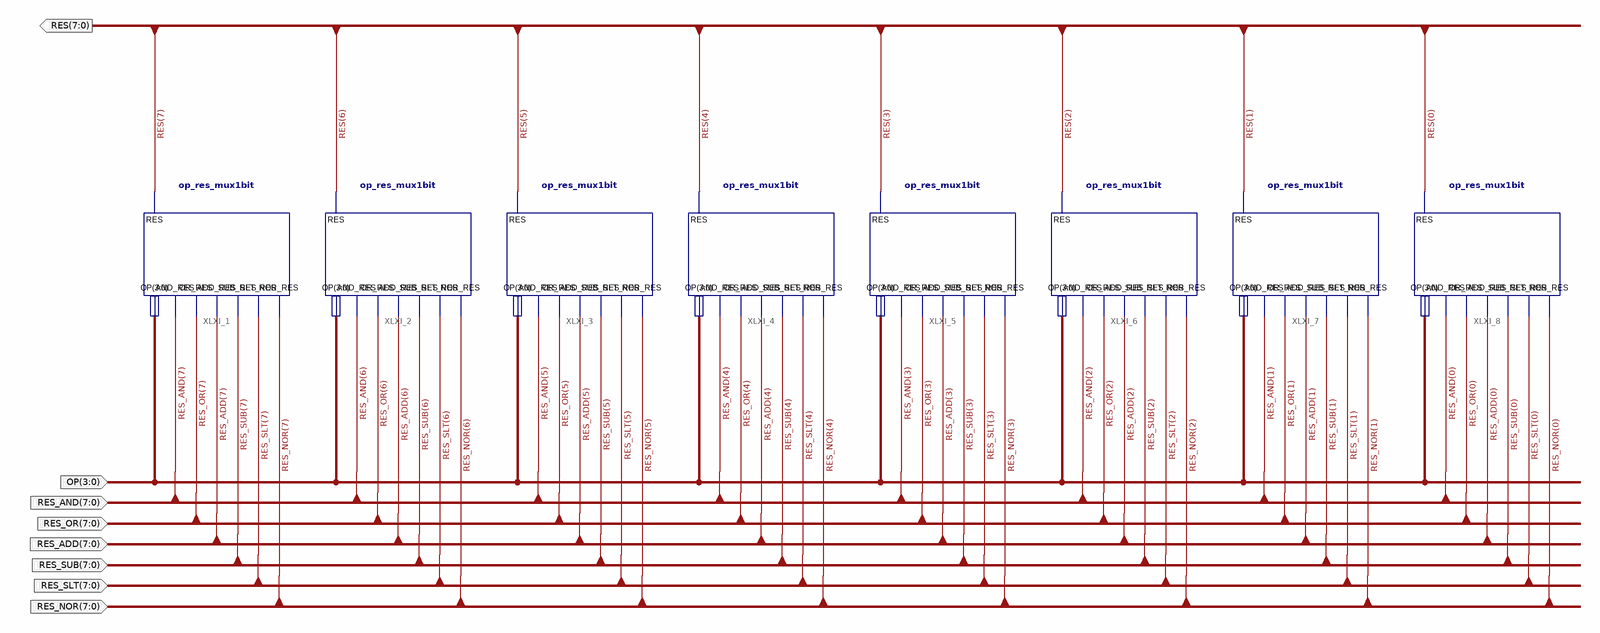
[diagram p0: schematic sheet 1]
// Xilinx ISE schematic op_res_mux8bit.sch (spartan3e) as structural Verilog: 8 symbols, 8 ports
module op_res_mux8bit (
  input  [3:0] OP,
  input  [7:0] RES_AND,
  input  [7:0] RES_OR,
  input  [7:0] RES_ADD,
  input  [7:0] RES_SUB,
  input  [7:0] RES_SLT,
  input  [7:0] RES_NOR,
  output [7:0] RES
);

  op_res_mux1bit XLXI_1 (
    .RES(RES[7]), .ADD_RES(RES_ADD[7]), .SUB_RES(RES_SUB[7]), .SLT_RES(RES_SLT[7]), .NOR_RES(RES_NOR[7]),
    .AND_RES(RES_AND[7]), .OR_RES(RES_OR[7]), .OP(OP));
  op_res_mux1bit XLXI_2 (
    .RES(RES[6]), .ADD_RES(RES_ADD[6]), .SUB_RES(RES_SUB[6]), .SLT_RES(RES_SLT[6]), .NOR_RES(RES_NOR[6]),
    .AND_RES(RES_AND[6]), .OR_RES(RES_OR[6]), .OP(OP));
  op_res_mux1bit XLXI_3 (
    .RES(RES[5]), .ADD_RES(RES_ADD[5]), .SUB_RES(RES_SUB[5]), .SLT_RES(RES_SLT[5]), .NOR_RES(RES_NOR[5]),
    .AND_RES(RES_AND[5]), .OR_RES(RES_OR[5]), .OP(OP));
  op_res_mux1bit XLXI_4 (
    .RES(RES[4]), .ADD_RES(RES_ADD[4]), .SUB_RES(RES_SUB[4]), .SLT_RES(RES_SLT[4]), .NOR_RES(RES_NOR[4]),
    .AND_RES(RES_AND[4]), .OR_RES(RES_OR[4]), .OP(OP));
  op_res_mux1bit XLXI_6 (
    .RES(RES[2]), .ADD_RES(RES_ADD[2]), .SUB_RES(RES_SUB[2]), .SLT_RES(RES_SLT[2]), .NOR_RES(RES_NOR[2]),
    .AND_RES(RES_AND[2]), .OR_RES(RES_OR[2]), .OP(OP));
  op_res_mux1bit XLXI_7 (
    .RES(RES[1]), .ADD_RES(RES_ADD[1]), .SUB_RES(RES_SUB[1]), .SLT_RES(RES_SLT[1]), .NOR_RES(RES_NOR[1]),
    .AND_RES(RES_AND[1]), .OR_RES(RES_OR[1]), .OP(OP));
  op_res_mux1bit XLXI_8 (
    .RES(RES[0]), .ADD_RES(RES_ADD[0]), .SUB_RES(RES_SUB[0]), .SLT_RES(RES_SLT[0]), .NOR_RES(RES_NOR[0]),
    .AND_RES(RES_AND[0]), .OR_RES(RES_OR[0]), .OP(OP));
  op_res_mux1bit XLXI_5 (
    .RES(RES[3]), .ADD_RES(RES_ADD[3]), .SUB_RES(RES_SUB[3]), .SLT_RES(RES_SLT[3]), .NOR_RES(RES_NOR[3]),
    .AND_RES(RES_AND[3]), .OR_RES(RES_OR[3]), .OP(OP));
endmodule
